# Altium project Grupo 1.PrjPcb
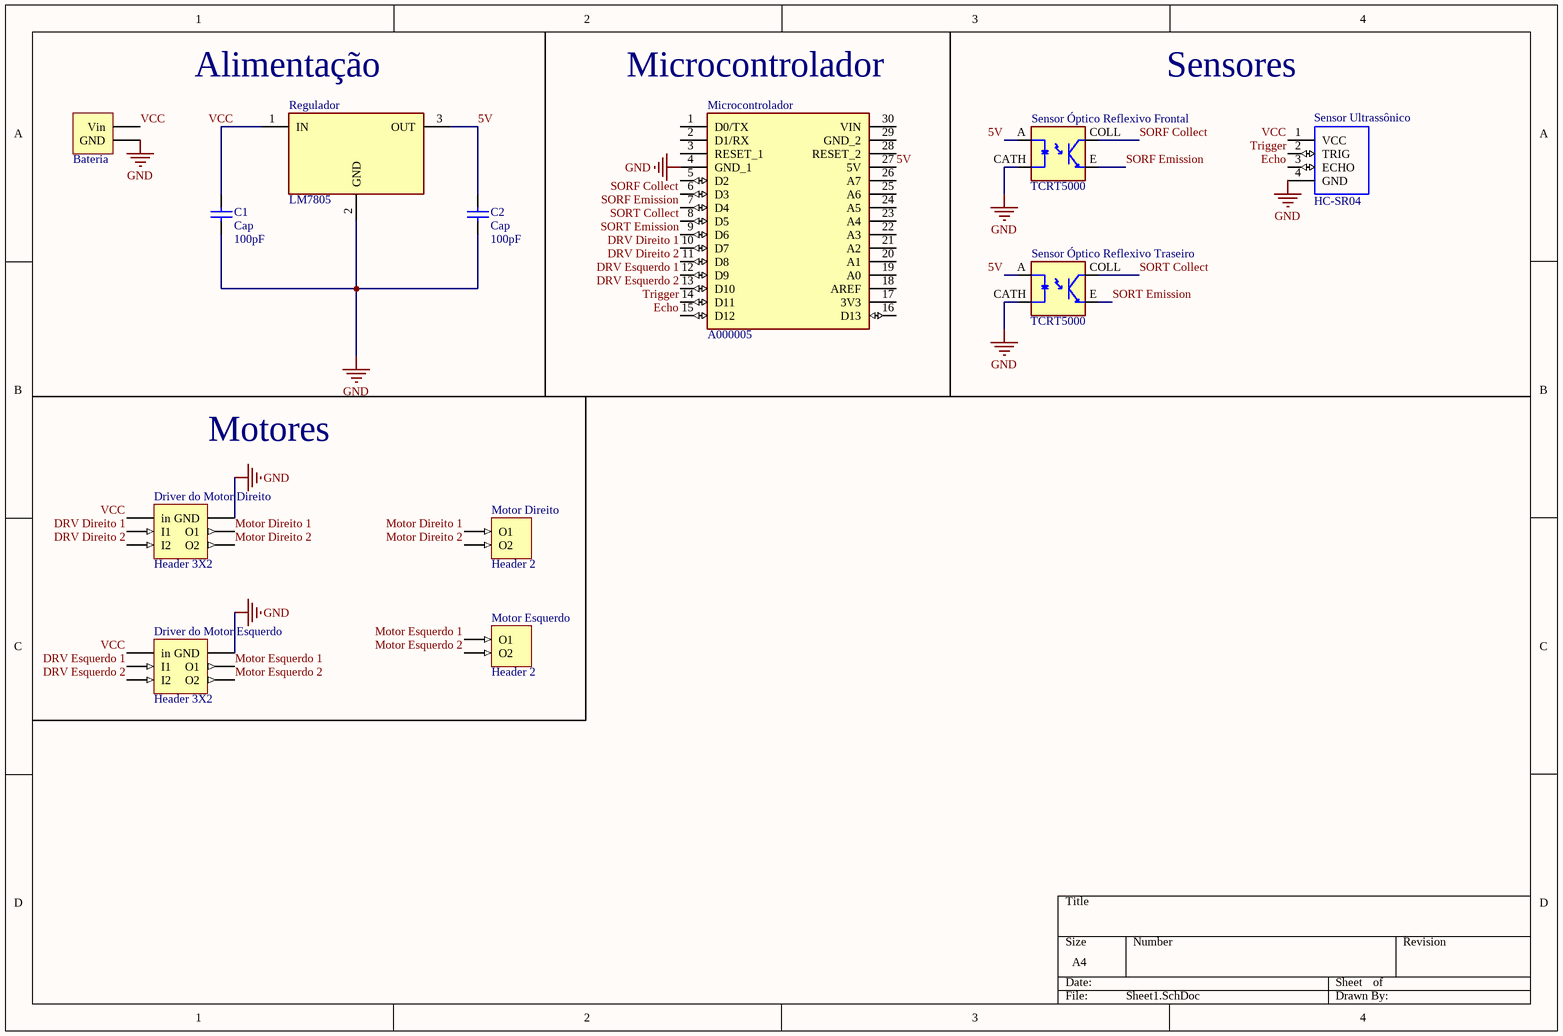
[diagram p0: Sheet1.SchDoc]
1 sheet, 12 parts. Net scope: global (net labels, ports and power ports of the same name join across sheets).
Board file: Sheet1.PcbDoc

## Sheet Sheet1.SchDoc
size A4; SheetNumber: 1; SheetTotal: 1

### Parts
C1  Cap  value 100pF  [RAD-0.3]
C2  Cap  value 100pF  [RAD-0.3]
Driver_do_Motor_Direito  Header 3X2  [HDR2X3]
Driver_do_Motor_Esquerdo  Header 3X2  [HDR2X3]
Microcontrolador  A000005  [MODULE_A000005]
Motor_Direito  Header 2  [HDR1X2]
Motor_Esquerdo  Header 2  [HDR1X2]
Regulador  LM7805  [TO220]
Sensor_Ultrassônico  HC-SR04  [XCVR_HC-SR04]
Sensor_Óptico_Reflexivo_Frontal  TCRT5000  [OPTO_TCRT5000]
Sensor_Óptico_Reflexivo_Traseiro  TCRT5000  [OPTO_TCRT5000]
  Bateria  [HDR1X2]

### Nets
GND: C1.1 C2.1 Driver_do_Motor_Direito.2(GND) Driver_do_Motor_Esquerdo.2(GND) Microcontrolador.4(GND_1) Regulador.2(GND) Sensor_Ultrassônico.4(GND) Sensor_Óptico_Reflexivo_Frontal.CATH Sensor_Óptico_Reflexivo_Traseiro.CATH .GND
5V: C2.2 Microcontrolador.27(5V) Regulador.3(OUT) Sensor_Óptico_Reflexivo_Frontal.A Sensor_Óptico_Reflexivo_Traseiro.A
DRV Direito 1: Driver_do_Motor_Direito.3(I1) Microcontrolador.10(D7)
DRV Direito 2: Driver_do_Motor_Direito.5(I2) Microcontrolador.11(D8)
DRV Esquerdo 1: Driver_do_Motor_Esquerdo.3(I1) Microcontrolador.12(D9)
DRV Esquerdo 2: Driver_do_Motor_Esquerdo.5(I2) Microcontrolador.13(D10)
Echo: Microcontrolador.15(D12) Sensor_Ultrassônico.3(ECHO)
Motor Direito 1: Driver_do_Motor_Direito.4(O1) Motor_Direito.1(O1)
Motor Direito 2: Driver_do_Motor_Direito.6(O2) Motor_Direito.2(O2)
Motor Esquerdo 1: Driver_do_Motor_Esquerdo.4(O1) Motor_Esquerdo.1(O1)
Motor Esquerdo 2: Driver_do_Motor_Esquerdo.6(O2) Motor_Esquerdo.2(O2)
SORF Collect: Microcontrolador.6(D3) Sensor_Óptico_Reflexivo_Frontal.COLL
SORF Emission: Microcontrolador.7(D4) Sensor_Óptico_Reflexivo_Frontal.E
SORT Collect: Microcontrolador.8(D5) Sensor_Óptico_Reflexivo_Traseiro.COLL
SORT Emission: Microcontrolador.9(D6) Sensor_Óptico_Reflexivo_Traseiro.E
Trigger: Microcontrolador.14(D11) Sensor_Ultrassônico.2(TRIG)
VCC: C1.2 Driver_do_Motor_Direito.1(in) Driver_do_Motor_Esquerdo.1(in) Regulador.1(IN) Sensor_Ultrassônico.1(VCC) .Vin

Not connected (* = marked no-connect by the designer): Microcontrolador 1(D0/TX) 2(D1/RX) 3(RESET_1) 5(D2) 16(D13) 17(3V3) 18(AREF) 19(A0) 20(A1) 21(A2) 22(A3) 23(A4) 24(A5) 25(A6) 26(A7) 28(RESET_2) 29(GND_2) 30(VIN)

### Notes on the sheet
- (near Regulador) Alimentação
- (near Microcontrolador) Microcontrolador
- Sensores
- Motores

### Library data of the parts
C1 C2 = Cap: Capacitor; Published: 8-Jun-2000; LatestRevisionDate: 17-Jul-2002; LatestRevisionNote: Re-released for DXP Platform.; PackageReference: RAD-0.3; Publisher: Altium Limited; PackageDescription: Radial Cap, Thru-Hole; 2 Leads; 0.3 in Pin Spacing
Driver_do_Motor_Direito Driver_do_Motor_Esquerdo = Header 3X2: Header, 3-Pin, Dual row; LatestRevisionDate: 17-Jul-2002; LatestRevisionNote: Re-released for DXP Platform.; Publisher: Altium Limited
Microcontrolador = A000005: CLOCK SAW OSCILLATOR SEAM7050 T&; Value: *; MP: A000005; Package: None; Availability: Unavailable; Price: None
Motor_Direito Motor_Esquerdo  = Header 2: Header, 2-Pin
Sensor_Ultrassônico = HC-SR04: Ultrasonic Sensor Module; Value: *; Availability: Unavailable; Price: None; MP: HC-SR04; Package: None
Sensor_Óptico_Reflexivo_Frontal Sensor_Óptico_Reflexivo_Traseiro = TCRT5000: 950 nm 60 mA Through Hole Reflective Optical Sensor with Transistor Output; Value: *; Availability: Unavailable; Price: None; Package: None; MP: TCRT5000
Regulador = LM7805: Package: None; Availability: Unavailable; Value: *; MP: LM7805; Price: None